# Altium schematic sheet Regulators.SchDoc
size Letter; CompanyName: Ploopy Corporation; Organization: Ploopy Corporation; Address1: 137-1140 Burnhamthorpe Road W; Address2: Mississauga; Address3: Ontario; Address4: Canada L5C 0A3; DocumentNumber: 6; Revision: R1.001; SheetNumber: 6; SheetTotal: 7
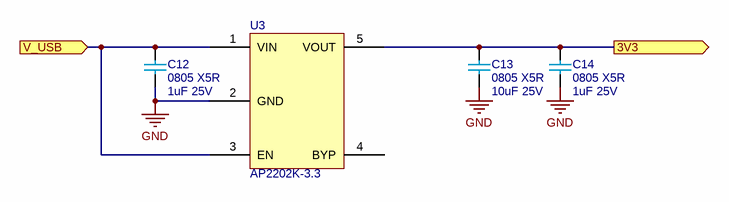
[diagram p0: Regulators.SchDoc]

## Parts
C12  0805 X5R  value 1uF 25V  [0805 - TALL]
C13  0805 X5R  value 10uF 25V  [0805 - TALL]
C14  0805 X5R  value 1uF 25V  [0805 - TALL]
U3  AP2202K-3.3  [AP2202 - SOT95P270X145-5N]

## Ports
3V3 (out), V_USB (in)

## Nets
GND: C12.1 C13.1 C14.1 U3.2(GND)
3V3: C13.2 C14.2 U3.5(VOUT) ; port 3V3
V_USB: C12.2 U3.1(VIN) U3.3(EN) ; port V_USB

Not connected (* = marked no-connect by the designer): U3 4(BYP)

## Notes on the sheet
- Copyright Ploopy Corporation
- Licensed under the CERN-OHL-S v2
- http://ohwr.org/cernohl
- Title:
- PCB:
- Version:
- Ploopy Corporation
- Mississauga ON L5C 0A3
- 137-1140 Burnhamthorpe Road W
- Date:
- Time:
- Sheet
- of
- Canada

## Library data of the parts
C12 C14 = Cap 1uF 25V: 0805, X5R or better; Supplier 1: Digi-Key; Supplier Part Number 1: 1276-1066-2-ND; Supplier 2: Digi-Key; Supplier Part Number 2: 1276-1066-1-ND
C13 = Cap 10uF 25V: 0805, X5R or better; Supplier 1: Mouser; Supplier Part Number 1: 81-GRM21BR61E106KA3L; Supplier 2: Digi-Key; Supplier Part Number 2: 490-5523-1-ND
U3 = AP2202K-3.3: 3.3V 150mA LDO regulator; Supplier 1: Mouser; Supplier Part Number 1: 621-AP2202K-3.3TRG1; Supplier 2: Digi-Key; Supplier Part Number 2: AP2202K-3.3TRG1DICT-ND; Supplier 3: Arrow; Supplier Part Number 3: PWagzdsTFFHKE_U17B45SP-NtndBrheJIaI5hB7gHD0ZVywxIBNyoAQstvnyfZZ0